# Altium schematic sheet STM32L0_PINOUT.SchDoc
size B; SheetNumber: 3; SheetTotal: 7
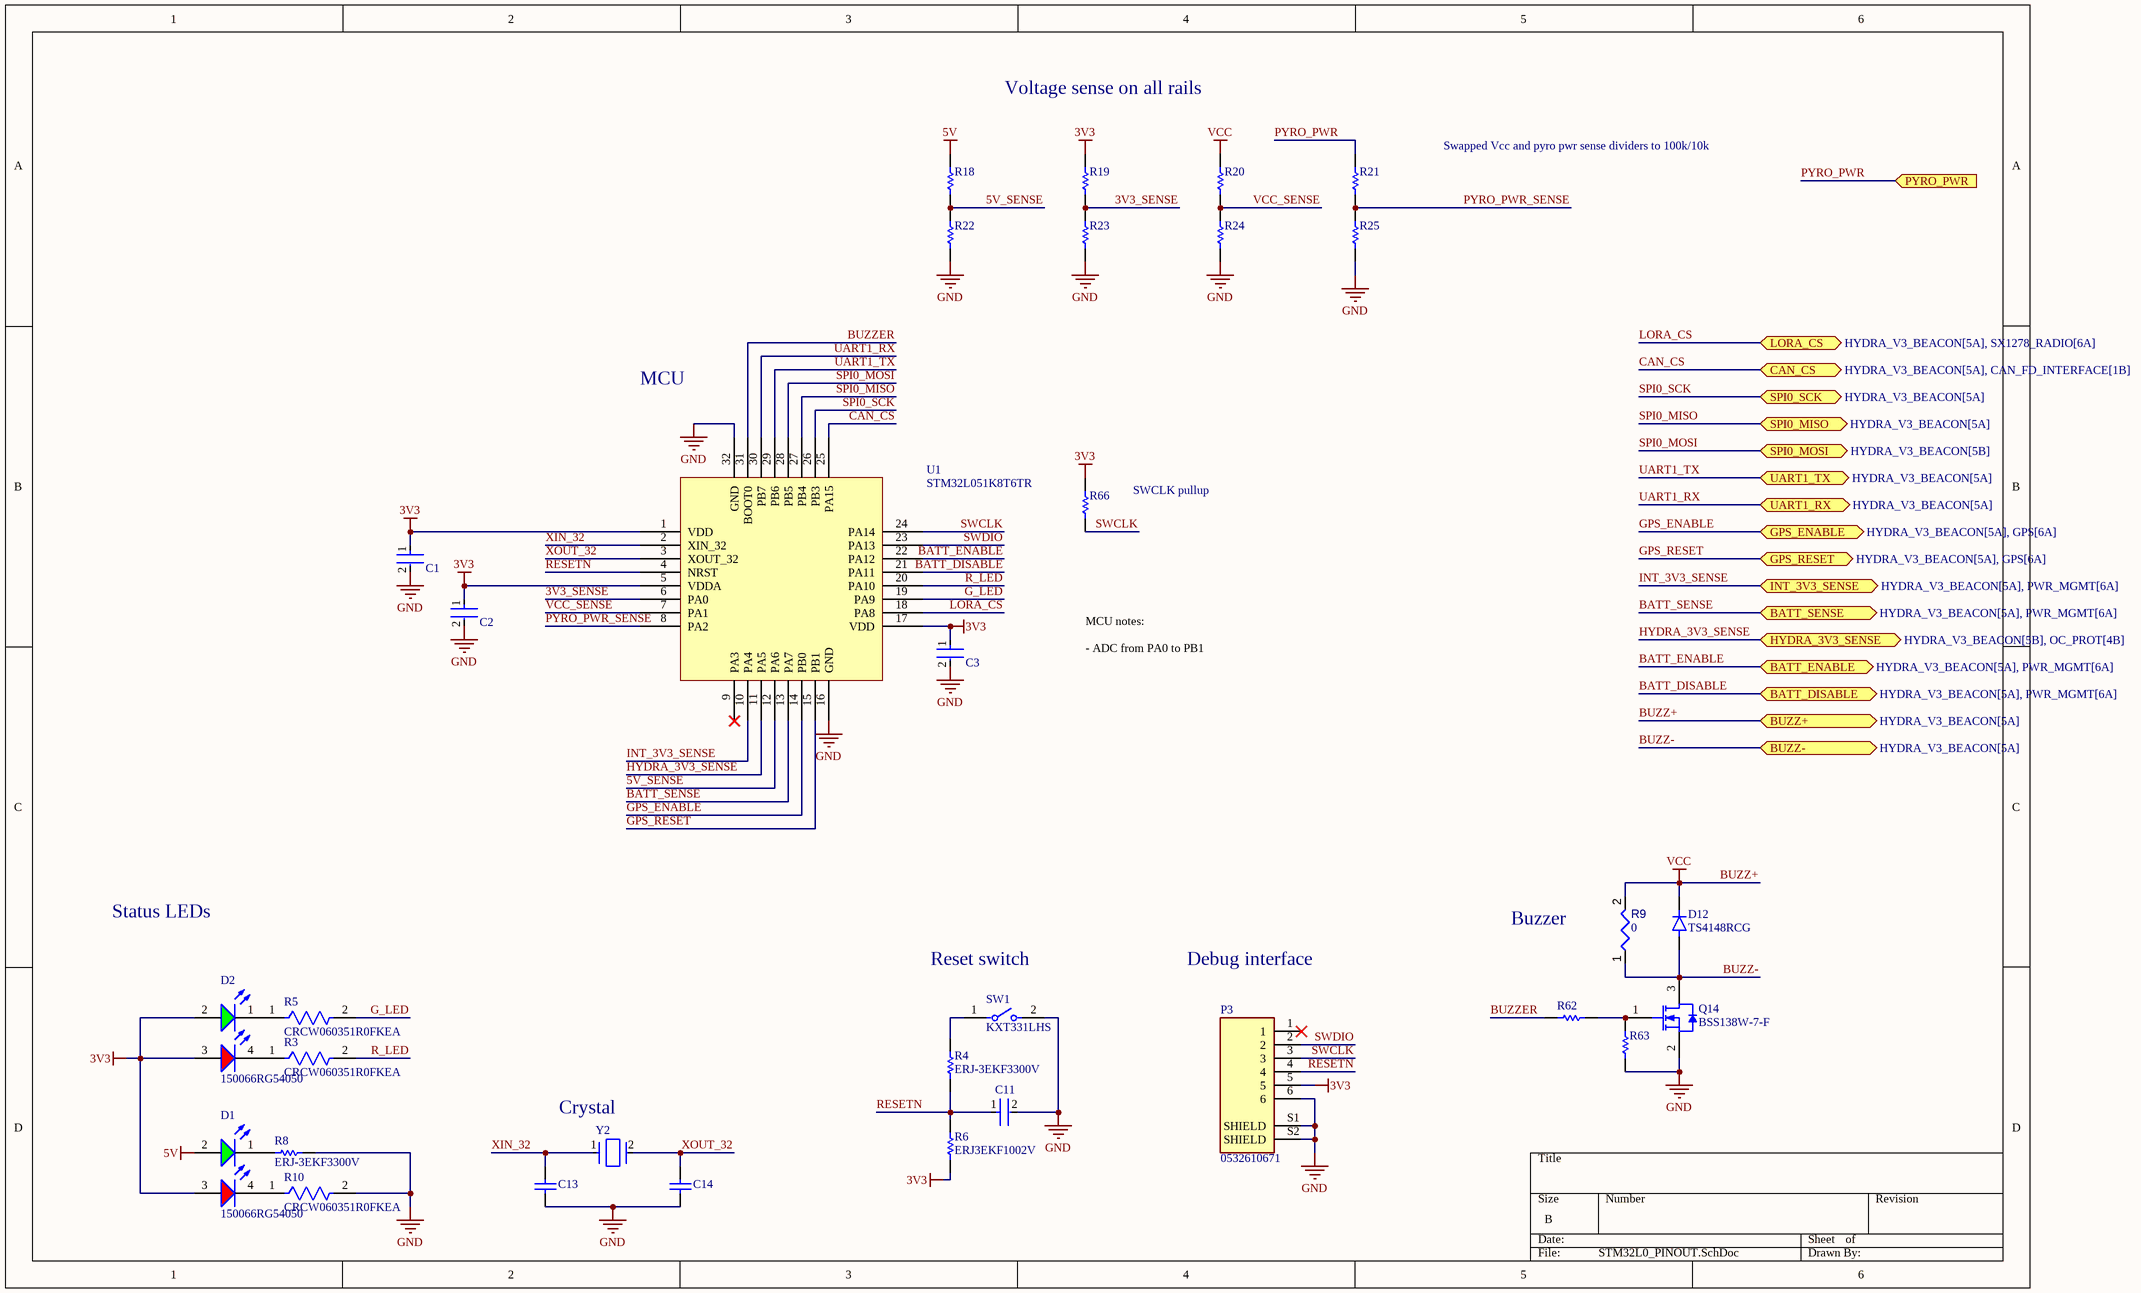
[diagram p0: STM32L0_PINOUT.SchDoc]

## Parts
C1  C0402C104K8PACTU  [FP-C0402-BB-MFG]  (value not drawn)
C2  C0402C104K8PACTU  [FP-C0402-BB-MFG]  (value not drawn)
C3  C0402C104K8PACTU  [FP-C0402-BB-MFG]  (value not drawn)
C11  C0402C104K8PACTU  [FP-C0402-BB-MFG]  (value not drawn)
C13  CC0603JRNPO9BN180  [CAPC1608X90X40LL10T20]  (value not drawn)
C14  CC0603JRNPO9BN180  [CAPC1608X90X40LL10T20]  (value not drawn)
D1  150066RG54050  [WL-SBCD_0606]
D2  150066RG54050  [WL-SBCD_0606]
D12  TS4148RCG  [TS4148RCG-Footprint-1]
P3  0532610671  [0532610671-Footprint-1]
Q14  BSS138W-7-F  [DIOD-SOT323-3_V]
R3  CRCW060351R0FKEA  [FP-CRCW0603-e3-MFG]
R4  ERJ-3EKF3300V  [RESC1608X55X30LL15T15]
R5  CRCW060351R0FKEA  [FP-CRCW0603-e3-MFG]
R6  ERJ3EKF1002V  [RESC1609X55X30LL15T15]
R8  ERJ-3EKF3300V  [RESC1608X55X30LL15T15]
R9  value 0  [RESC0603(1608)_L]  (hidden comment: 0R3J)
R10  CRCW060351R0FKEA  [FP-CRCW0603-e3-MFG]
R18  ERJ3EKF1002V  [RESC1609X55X30LL15T15]  (value not drawn)
R19  ERJ3EKF1002V  [RESC1609X55X30LL15T15]  (value not drawn)
R20  ERJ-3EKF1003V  [RESC1608X55X30ML15T15]  (value not drawn)
R21  ERJ-3EKF1003V  [RESC1608X55X30ML15T15]  (value not drawn)
R22  ERJ3EKF1002V  [RESC1609X55X30LL15T15]  (value not drawn)
R23  ERJ3EKF1002V  [RESC1609X55X30LL15T15]  (value not drawn)
R24  ERJ3EKF1002V  [RESC1609X55X30LL15T15]  (value not drawn)
R25  ERJ3EKF1002V  [RESC1609X55X30LL15T15]  (value not drawn)
R62  ERJ-3EKF1001V  [RESC1608X55X30LL15T15]  (value not drawn)
R63  ERJ3EKF1002V  [RESC1609X55X30LL15T15]  (value not drawn)
R66  ERJ3EKF1002V  [RESC1609X55X30LL15T15]  (value not drawn)
SW1  KXT331LHS  [FP-KXT331LHS-MFG]
U1  STM32L051K8T6TR  [CQFP80P1115X1115X160-32N]
Y2  ECS-.327-12.5-1210-TR  [FP-ECX-1210-MFG]  (value not drawn)

## Ports
BATT_DISABLE (bidir, see HYDRA_V3_BEACON[5A], PWR_MGMT[6A]), BATT_ENABLE (bidir, see HYDRA_V3_BEACON[5A], PWR_MGMT[6A]), BATT_SENSE (bidir, see HYDRA_V3_BEACON[5A], PWR_MGMT[6A]), BUZZ+ (bidir, see HYDRA_V3_BEACON[5A]), BUZZ- (bidir, see HYDRA_V3_BEACON[5A]), CAN_CS (bidir, see HYDRA_V3_BEACON[5A], CAN_FD_INTERFACE[1B]), GPS_ENABLE (bidir, see HYDRA_V3_BEACON[5A], GPS[6A]), GPS_RESET (bidir, see HYDRA_V3_BEACON[5A], GPS[6A]), HYDRA_3V3_SENSE (bidir, see HYDRA_V3_BEACON[5B], OC_PROT[4B]), INT_3V3_SENSE (bidir, see HYDRA_V3_BEACON[5A], PWR_MGMT[6A]), LORA_CS (bidir, see HYDRA_V3_BEACON[5A], SX1278_RADIO[6A]), PYRO_PWR (in, see HYDRA_V3_BEACON[5A]), SPI0_MISO (bidir, see HYDRA_V3_BEACON[5A]), SPI0_MOSI (bidir, see HYDRA_V3_BEACON[5B]), SPI0_SCK (bidir, see HYDRA_V3_BEACON[5A]), UART1_RX (bidir, see HYDRA_V3_BEACON[5A]), UART1_TX (bidir, see HYDRA_V3_BEACON[5A])

## Nets
3V3: C1.1 C2.1 C3.1 D1.3(A) D2.2(A) D2.3(A) P3.5 R6.1 R19.2 R66.2 U1.1(VDD) U1.5(VDDA) U1.17(VDD)
5V: D1.2(A) R18.2
BUZZ+: D12.C(K) R9.2 R20.2 ; port BUZZ+  [also labelled VCC]
GND: C1.2 C2.2 C3.2 C11.2 C13.1 C14.1 P3.6 P3.S1(SHIELD) P3.S2(SHIELD) Q14.2(S) R8.2 R10.2 R22.1 R23.1 R24.1 R25.1 R63.2 SW1.2 U1.16(GND) U1.32(GND)
3V3_SENSE: R19.1 R23.2 U1.6(PA0)
5V_SENSE: R18.1 R22.2 U1.12(PA6)
BATT_DISABLE: U1.21(PA11) ; port BATT_DISABLE
BATT_ENABLE: U1.22(PA12) ; port BATT_ENABLE
BATT_SENSE: U1.13(PA7) ; port BATT_SENSE
BUZZ-: D12.A Q14.3(D) R9.1 ; port BUZZ-
BUZZER: R62.2 U1.31(BOOT0)
CAN_CS: U1.25(PA15) ; port CAN_CS
G_LED: R5.2 U1.19(PA9)
GPS_ENABLE: U1.14(PB0) ; port GPS_ENABLE
GPS_RESET: U1.15(PB1) ; port GPS_RESET
HYDRA_3V3_SENSE: U1.11(PA5) ; port HYDRA_3V3_SENSE
INT_3V3_SENSE: U1.10(PA4) ; port INT_3V3_SENSE
LORA_CS: U1.18(PA8) ; port LORA_CS
PYRO_PWR: R21.2 ; port PYRO_PWR
PYRO_PWR_SENSE: R21.1 R25.2 U1.8(PA2)
R_LED: R3.2 U1.20(PA10)
RESETN: C11.1 P3.4 R4.1 R6.2 U1.4(NRST)
SPI0_MISO: U1.27(PB4) ; port SPI0_MISO
SPI0_MOSI: U1.28(PB5) ; port SPI0_MOSI
SPI0_SCK: U1.26(PB3) ; port SPI0_SCK
SWCLK: P3.3 R66.1 U1.24(PA14)
SWDIO: P3.2 U1.23(PA13)
UART1_RX: U1.30(PB7) ; port UART1_RX
UART1_TX: U1.29(PB6) ; port UART1_TX
VCC_SENSE: R20.1 R24.2 U1.7(PA1)
XIN_32: C13.2 U1.2(XIN_32) Y2.1(In/Out)
XOUT_32: C14.2 U1.3(XOUT_32) Y2.2(Out/In)
NetD1_1: D1.1(K) R8.1
NetD1_4: D1.4(K) R10.1
NetD2_1: D2.1(K) R5.1
NetD2_4: D2.4(K) R3.1
NetQ14_1: Q14.1(G) R62.1 R63.1
NetR4_2: R4.2 SW1.1

Not connected (* = marked no-connect by the designer): P3 1*; U1 9(PA3)*

## Notes on the sheet
- Voltage sense on all rails
- Swapped Vcc and pyro pwr sense dividers to 100k/10k
- MCU
- (near R66) SWCLK pullup
- MCU notes:
  - ADC from PA0 to PB1
- Status LEDs
- (near SW1) Reset switch
- Debug interface
- Buzzer
- (near Y2) Crystal

## Library data of the parts
C1-C3 C11 = CMP-2008-02046-2: CAP CER 0.1UF 10V X5R 0402; Manufacturer: Kemet; Material: Ceramic; Capacitance: 0.10 μF; Temperature Coefficient: 15%; Tolerance: 0.1; Value: 0.10 μF; Package: C0402-BB; Temperature: -55°C to +125°C; ComponentLink2Description: Datasheet; Temperature Characteristic: X5R; Device Class L1: Passive Components; Height: 0.55mm; Lead Free: Yes; ComponentLink2URL: https://content.kemet.com/datasheets/KEM_C1002_X7R_SMD.pdf; Device Class L2: Capacitors; Temperature Range Low: -55°C; Temperature Range High: +125°C; RoHS: TRUE; Octopart: https://octopart.com/c0402c104k8pactu-kemet-140039; Automotive: No; Mouser Description: Capacitor 100 nF 10 VDC 0402; Category: Cap; Voltage Rating: 10 V; Digikey Description: CAP CER 0.1UF 10V X5R 0402; Ipc Land Pattern Name: CAPC10050X50; Device Class L3: Ceramic Capacitors; Manufacturer Part Number: C0402C104K8PACTU
C13 C14 = CMP-1659-00030-1: Chip Capacitor, 18 pF, +/- 5%, 50 V, -55 to 125 degC, 0603 (1608 Metric), RoHS, Tape and Reel; Voltage Rating: 50 V; Case\Package: 0603; Power Rating: 100 mW; Resistance: 68.1 Ohm; Tolerance: 1%; Case Code (Metric): 1608; Max Operating Temperature: 155 degC; RoHSCompliant: true; Case Code (Imperial): 0603; ComponentLink2Description: Datasheet; Package Quantity: 200; PackageReference: 0603; ComponentLink2URL: http://www.yageo.com/NewPortal/yageodocoutput?fileName=/pdf/MLCC/UPY-GP_NP0_16V-to-50V_14.pdf; Length: 1.6 mm; DatasheetVersion: Rev. 14, 07/2016; Min Operating Temperature: -55 degC; ComponentLink1URL: http://www.yageo.com/; Width: 0.8 mm; ComponentLink1Description: Manufacturer URL; Height: 0.45 mm; Radiation Hardening: No; PackageDescription: 2-Pin Surface Mount Device, Body 1.6 x 0.8 mm; Packaging: Tape and Reel
D1 D2 = CMP-004-00034-2: Led, Red/Grn, 180Mcd/230Mcd, 624Nm/525Nm Rohs Compliant: Yes
D12 = CMP-004-00036-1: SMD Si-Diode 75V 100mA 0603
P3 = CMP-002-00079-1: Conn Shrouded Header (4 Sides) HDR 6 POS 1.25mm Solder RA Side Entry SMD PicoBlade™ T/R
Q14 = CMP-2000-05968-1: N-Channel Enhancement Mode Mosfet, 50 V, 200 mA, -55 to 150 degC, 6-Pin SOT-323, RoHS, Tape and Reel; Typical Turn-Off Delay Time: 20ns; Number of Channels: 1Channel; Type: EnhancementModeFieldEffectTransistor; Brand: DiodesIncorporated; Vds - Drain-Source Breakdown Voltage: 75V; Vgs - Gate-Source Voltage: 20V; Rds On - Drain-Source Resistance: 1.4Ohms; Transistor Type: 1N-Channel; Configuration: Single; Unit Weight: 0.000212oz; Pd - Power Dissipation: 200mW; Id - Continuous Drain Current: 200mA; Forward Transconductance - Min: 0.1S; Manufacturer URL: http://www.diodes.com/; Series: BSS138; Package Description: 3-Pin Small Outline Transistor, Body 2 x 1.25 mm, Pitch 0.65 mm; Mounting Technology: SurfaceMount; Product Category: MOSFET; RoHS: True; Maximum Operating Temperature: +150C; Height: 1mm; Length: 2.2mm; Technology: Si; Width: 1.35mm; Datasheet URL: http://www.diodes.com/_files/datasheets/ds30206.pdf; Manufacturer: DiodesIncorporated; Package / Case: SOT-323-3; Typical Turn-On Delay Time: 20ns; Transistor Polarity: N-Channel; Factory Pack Quantity: 3000; Packaging: Reel; Product: MOSFETSmallSignal; Datasheet Version: Rev. 11-2, 09/2013; Package Reference: SOT323; Minimum Operating Temperature: -55C; Mounting Style: SMD/SMT; Channel Mode: Enhancement
R3 R5 R10 = CMP-2000-03446-2: RES Thick Film, 51Ω, 1%, 0.1W, 100ppm/°C, 0603; Power Rating: 100mW; Voltage Rating: 75V; Resistance: 51R; Military Standard: Not; Case Code (Imperial): 0603; Max Operating Temperature: 155°C; Temperature Coefficient: 100ppm/°C; Lead Free: Lead Free; Weight: 7.1E-05oz; Number of Pins: 2; Package Quantity: 10; Case/Package: 0603; Termination: SMD/SMT; Min Operating Temperature: -55°C; Tolerance: 1%; Contact Plating: Tin; Height: 0.45mm; Working Voltage: 75V; Radiation Hardening: No; Packaging: Tape and Reel; Composition: Thick Film; Max Power Dissipation: 100mW; Width: 0.85mm; Depth: 0.85mm; Length: 1.55mm; Case Code (Metric): 1608; Voltage Rating (DC): 75V; Number of Terminations: 2; Features: Automotive AEC-Q200
R4 R8 = CMP-2000-00435-2: Chip Resistor, 330 Ohm, +/- 1%, 0.1 W, -55 to 155 degC, 0603 (1608 Metric), RoHS, Tape and Reel; Gender: Male; Mating Cycles: 10000; Current Rating: 500 mA; Voltage Rating: 10 V; REACH SVHC: No SVHC; PackageDescription: 2-Pin Surface Mount Device, Body 1.6 x 0.85 mm; Contact Finish: Gold; Pins: 8; ComponentLink1Description: Manufacturer URL; Packaging: Tape and Reel; Max Operating Temperature: 85 degC; Contact Material: Copper; Height: 1.45 mm; Width: 1.45 mm; DatasheetVersion: Apr-15; Package Quantity: 1500; Contact Plating: Gold; PackageReference: 0603; Mount: Surface Mount; Lead Pitch: 1.1 mm; Min Operating Temperature: -25 degC; ComponentLink1URL: http://www.panasonic.com/; ComponentLink2URL: http://industrial.panasonic.com/cdbs/www-data/pdf/RDA0000/AOA0000C86.pdf; Length: 13.7 mm; ComponentLink2Description: Datasheet; RoHSCompliant: true
R6 R18 R19 R22-R25 R63 R66 = CMP-1012-00623-3: Chip Resistor, 10 KOhm, +/- 1%, 0.1 W, -55 to 155 degC, 0603 (1608 Metric), RoHS, Tape and Reel; Manufacturer: Panasonic; Voltage Rating: 75V; Case\/Package: 0603; Power Rating: 100mW; Resistance: 10KOhm; Temperature Coefficient: 100ppm\/degreesC; Number of Pins: 2; Package Reference: 603; Depth: 0.8mm; Mount: SurfaceMount; Package Description: 2-Pin Surface Mount Device, Body 1.6 x 0.85 mm; Datasheet Version: 02/2017; Length: 1.6mm; Lead Free: LeadFree; Height: 0.45mm; Number of Terminations: 2; Max Power Dissipation: 100mW; Min Operating Temperature: -55degC; Datasheet URL: https://industrial.panasonic.com/cdbs/www-data/pdf/RDA0000/AOA0000C304.pdf; Termination: SMD/SMT; Case Code (Metric): 1608; Case Code (Imperial): 0603; Tolerance: 1%; Max Operating Temperature: 155degC; RoHSCompliant: true; Voltage Rating (DC): 75V; Radiation Hardening: No; Packaging: TapeandReel; Composition: ThickFilm; Mounting Technology: SurfaceMount; Manufacturer URL: http://www.panasonic.com/; Width: 0.031inch; REACH SVHC: NoSVHC; Contact Plating: Tin; Military Standard: Not; Package Quantity: 1
R9 = CMP-009-00063-2: Jumper 0603 (1608 Metric); Case/Package: 0603; Mounting Technology: SMT; Pins: 2
R20 R21 = CMP-2000-00182-1: Manufacturer: Panasonic; Part Number: ERJ-3EKF1003V
R62 = CMP-2000-00180-1: Manufacturer: Panasonic; Part Number: ERJ-3EKF1001V
SW1 = CMP-10040-000029-1: SWITCH TACTILE SPST-NO 0.02A 15V; Operating Force: 240gf; Switch Travel: 0.13mm; Illumination Type: Non-Illuminated; Throw Configuration: SPST; Number of Ports: 1; Current Rating: 5A; Mechanical Life: 500000Cycles; Switch Function: Off-Mom; Connector Type: USB; Actuator Type: Standard; Gender: Receptacle; Number of Contacts: 24; Contact Plating: Gold; Insulation Color: Black; Min Operating Temperature: -40°C; Packaging: Tape and Reel; Flammability Rating: UL94 V-0; Max Operating Temperature: 85°C; Termination: Solder; Mount: Surface Mount
U1 = CMP-020-00025-2: MCU 32-Bit Ultra Low Power STM32L ARM Cortex M0+ RISC 64kB Flash 32-Pin LQFP T/R
Y2 = CMP-40224-000006-1: CRYSTAL 32.7680KHZ 12.5PF SMD; Manufacturer: ECS International; Frequency: 32.768kHz; Esr: 90kΩ; Tolerance: 20ppm; Device Class L1: Passive Components; Load Capacitance: 12.5pF; Temperature: -40°C to +85°C; ComponentLink2URL: https://ecsxtal.com/store/pdf/ECX-1210.pdf; Series: ECX-1210; Octopart: https://octopart.com/ecs-.327-12.5-1210-tr-ecs+international-81221340; ComponentLink2Description: Datasheet; Temperature Range Low: -40°C; Digikey Description: CRYSTAL 32.7680KHZ 12.5PF SMD; Lead Free: Yes; RoHS: TRUE; Device Class L3: Crystals; Automotive: No; Category: Crys; Height: 0.5mm; Manufacturer Part Number: ECS-.327-12.5-1210-TR; Temperature Range High: +85°C; Device Class L2: Crystals / Oscillators; Package: ECX-1210